# EAGLE design E-P-010-R1.0 SensorsPowerboard (EAGLE 7.5.0)
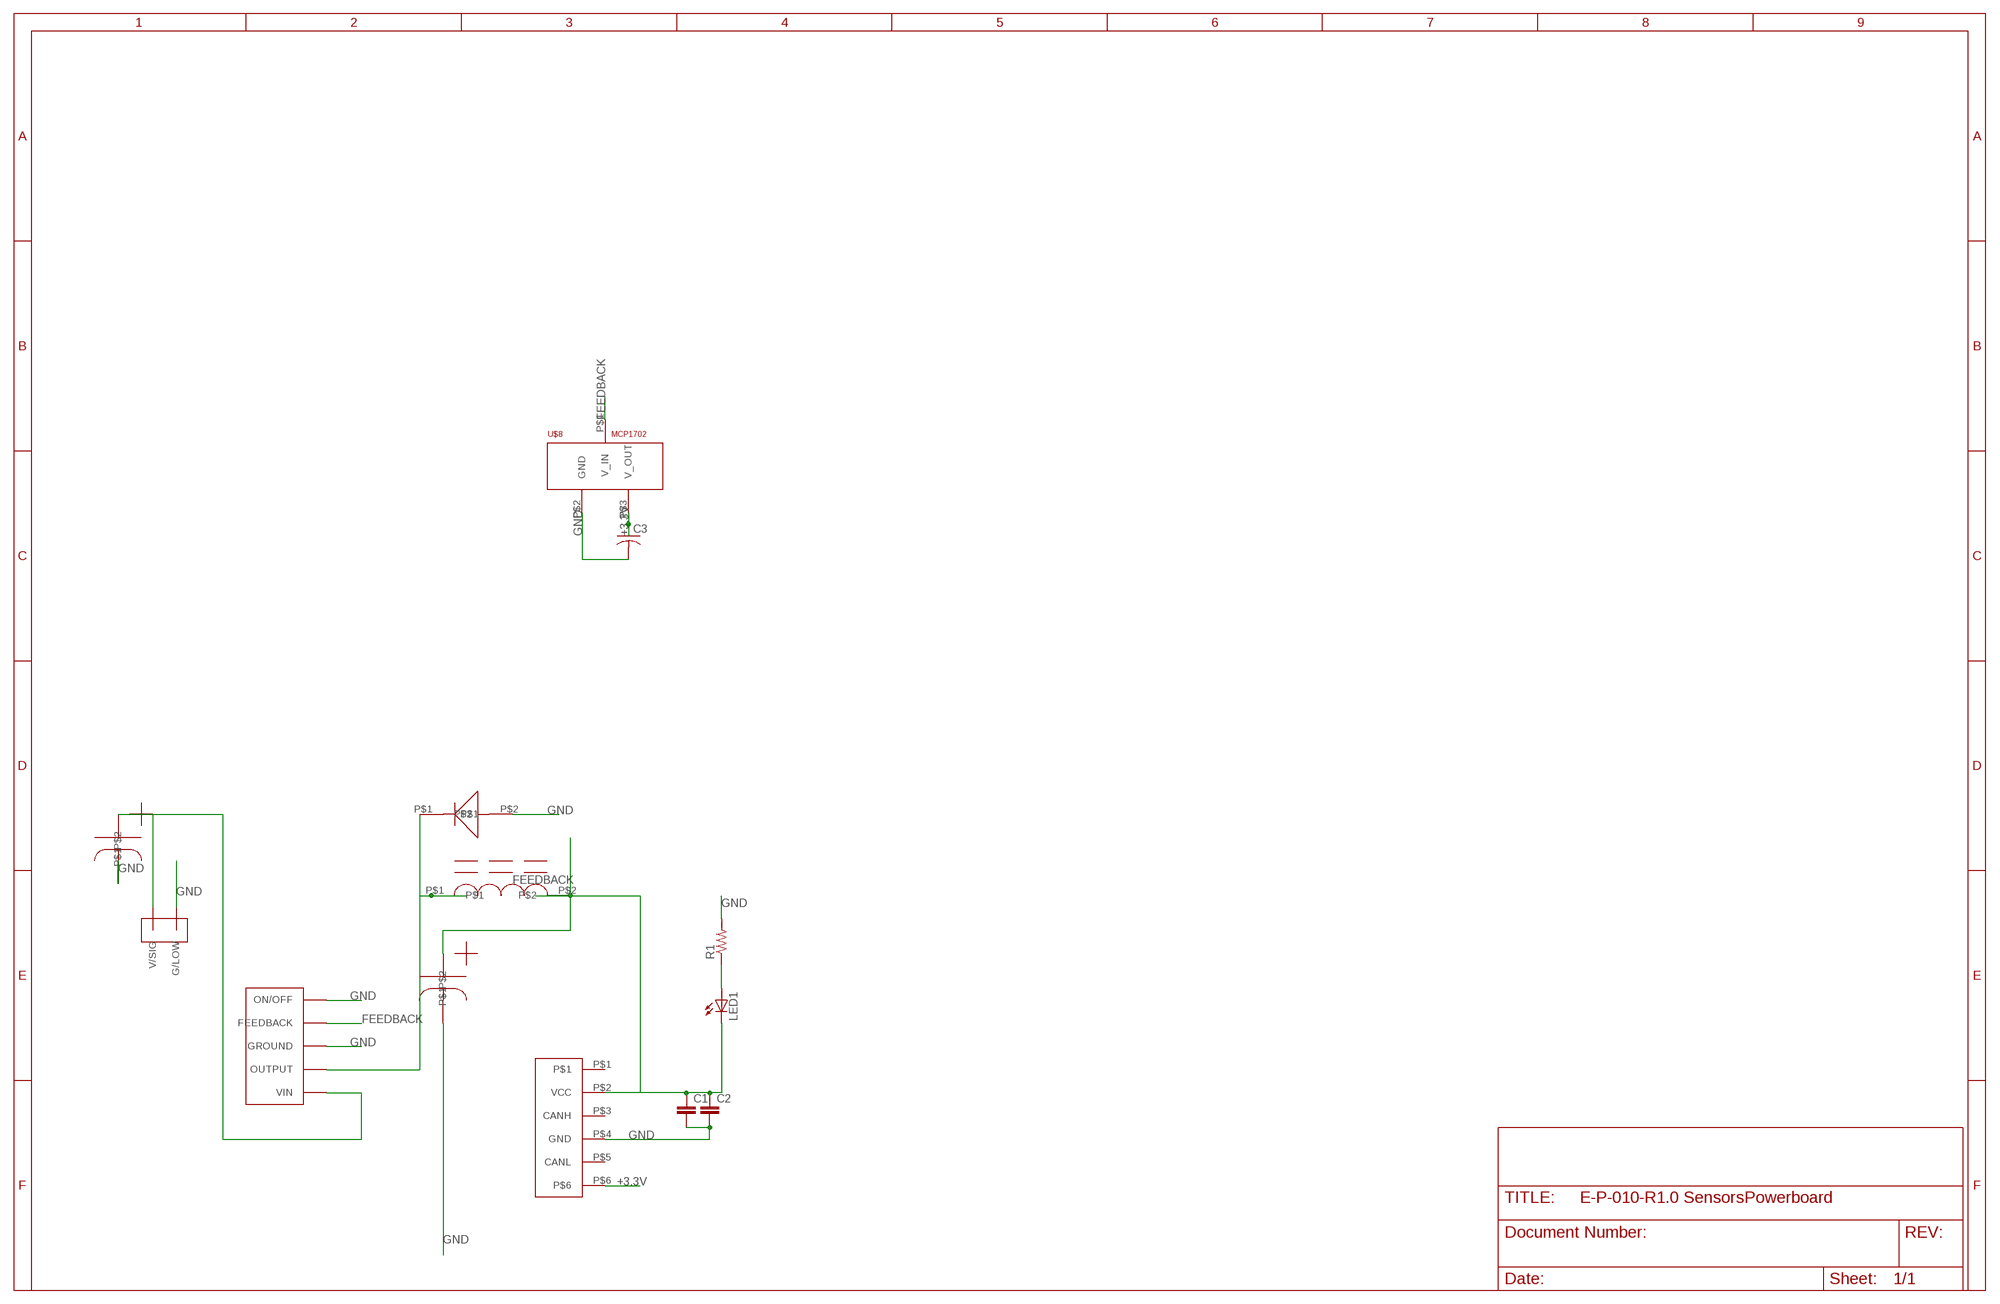
[diagram p0: schematic, sheet 1]

## Parts
C1  CAP0805  [0805]
C2  CAP0805  [0805]
C3  C-USC0805  [C0805]
LED1  LEDSMT1206  [1206]
R1  RESISTOR0805-RES  [0805]
U$1  LM2576  [D2PAK-5]
U$2  MBR360GOS  [MBR360GOS]
U$3  TE770966  [2X1-MATE-N-LOCK]
U$4  CAN_6P6C  [CAN_6P6C]
U$5  CAPESK107M025AC3AA  [ESK107M025AC3AA]
U$6  CAPESK108M025AH4EA  [ESK108M025AH4EA]
U$7  M1418-ND  [M1418-ND]
U$8  MCP1702  [SOT-23A]

## Nets
+3.3V: C3.1 U$4.P$6 U$8.P$3(V_OUT)
FEEDBACK: C1.1 C2.1 LED1.C U$1.4(FEEDBACK) U$4.P$2(VCC) U$6.P$1 U$7.P$2 U$8.P$1(V_IN)
GND: C1.2 C2.2 C3.2 R1.2 U$1.3(GROUND) U$1.5(ON/OFF) U$1.GROUND U$2.P$2 U$3.CIRCUIT2(G/LOW) U$4.P$4(GND) U$5.P$2 U$6.P$2 U$8.P$2(GND)
N$1: U$1.2(OUTPUT) U$2.P$1 U$7.P$1
N$3: LED1.A R1.1
V1: U$1.1(VIN) U$3.CIRCUIT1(V/SIG) U$5.P$1
Unconnected: U$4.P$1 U$4.P$3(CANH) U$4.P$5(CANL)

## Library data of the parts
C1 C2 = E-P-099-R2.2:CAP: Capacitor Standard 0603 ceramic capacitor, and 0.1" leaded capacitor.
C3 = adafruit:C-US: CAPACITOR, American symbol
LED1 = DAQTEST:LED: LED OSRAM: - CHIPLED LG R971, LG N971, LY N971, LG Q971, LY Q971, LO R971, LY R971 LH N974, LH R974 LS Q976, LO Q976, LY Q976 LO Q996 - Hyper CHIPLED LW Q18S LB Q993, LB Q99A, LB R99A - SideLED LS A670, LO A670, LY A670, LG A670, LP A670 LB A673, LV A673, LT A673, LW A673 LH A674 LY A675 LS A676, LA A676, LO A676, LY A676, LW A676 LS A679, LY A679, LG A679 - Hyper Micro SIDELED® LS Y876, LA Y876, LO Y876, LY Y876 LT Y87S - SmartLED LW L88C, LW L88S LB L89C, LB L89S, LG L890 LS L89K, LO L89K, LY L89K LS L896, LA L896, LO L896, LY L896 - TOPLED LS T670, LO T670, LY T670, LG T670, LP T670 LSG T670, LSP T670, LSY T670, LOP T670, LYG T670 LG T671, LOG T671, LSG T671 LB T673, LV T673, LT T673, LW T673 LH T674 LS T676, LA T676, LO T676, LY T676, LB T676, LH T676, LSB T676, LW T676 LB T67C, LV T67C, LT T67C, LS T67K, LO T67K, LY T67K, LW E67C LS E67B, LA E67B, LO E67B, LY E67B, LB E67C, LV E67C, LT E67C LW T67C LS T679, LY T679, LG T679 LS T770, LO T770, LY T770, LG T770, LP T770 LB T773, LV T773, LT T773, LW T773 LH T774 LS E675, LA E675, LY E675, LS T675 LS T776, LA T776, LO T776, LY T776, LB T776 LHGB T686 LT T68C, LB T68C - Hyper Mini TOPLED® LB M676 - Mini TOPLED Santana® LG M470 LS M47K, LO M47K, LY M47K Source: http://www.osram.convergy.de LUXEON: - LUMILED® LXK2-PW12-R00, LXK2-PW12-S00, LXK2-PW14-U00, LXK2-PW14-V00 LXK2-PM12-R00, LXK2-PM12-S00, LXK2-PM14-U00 LXK2-PE12-Q00, LXK2-PE12-R00, LXK2-PE12-S00, LXK2-PE14-T00, LXK2-PE14-U00 LXK2-PB12-K00, LXK2-PB12-L00, LXK2-PB12-M00, LXK2-PB14-N00, LXK2-PB14-P00, LXK2-PB14-Q00 LXK2-PR12-L00, LXK2-PR12-M00, LXK2-PR14-Q00, LXK2-PR14-R00 LXK2-PD12-Q00, LXK2-PD12-R00, LXK2-PD12-S00 LXK2-PH12-R00, LXK2-PH12-S00 LXK2-PL12-P00, LXK2-PL12-Q00, LXK2-PL12-R00 Source: www.luxeon.com KINGBRIGHT: KA-3528ASYC Source: www.kingbright.com
R1 = E-P-099-R2.2:RESISTOR: Resistor Basic schematic elements and footprints for 0603, 1206, and PTH resistors.
U$1 = Shell2015:LM2576
U$2 = Shell2013:MBR360GOS
U$3 = E-P-099-R2.2:TE770966
U$4 = Shell2013:CAN_6P6C: Digikey part: 553-2258-ND
U$5 U$6 = Shell2015:CAP
U$7 = Shell2015:M1418-ND: 100uF inductor
U$8 = Shell2015:MCP1702

## Board
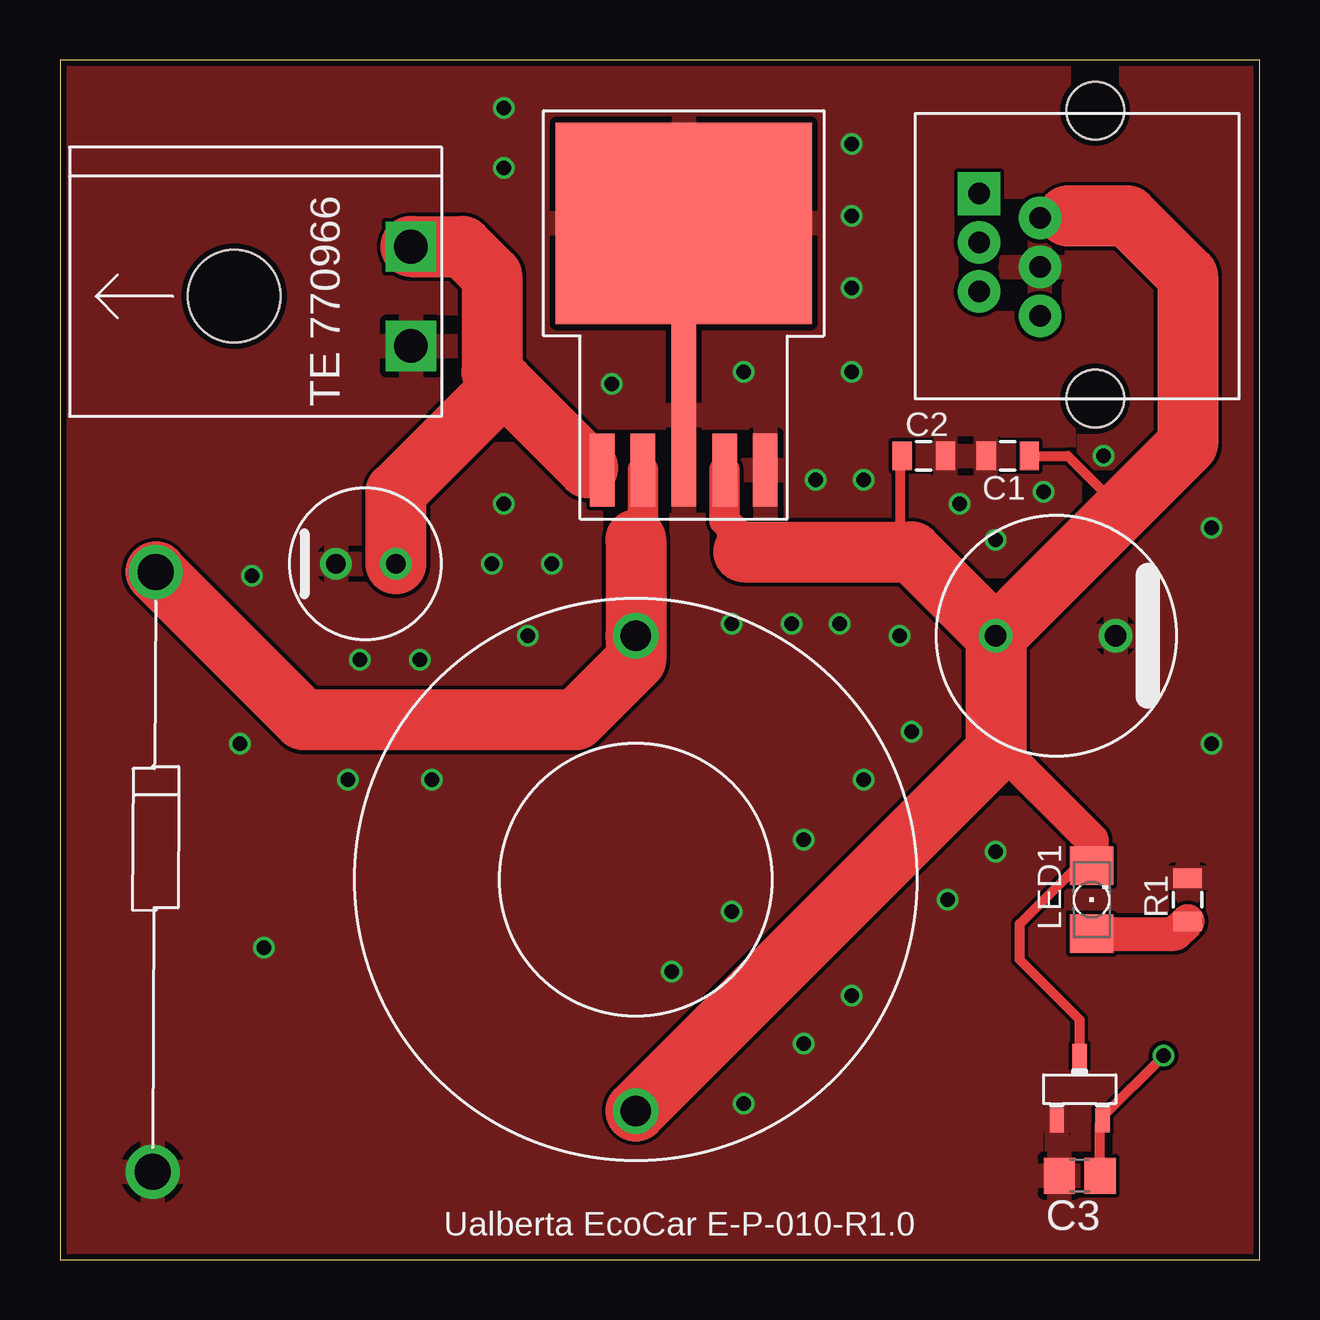
[diagram p1: board, top side]
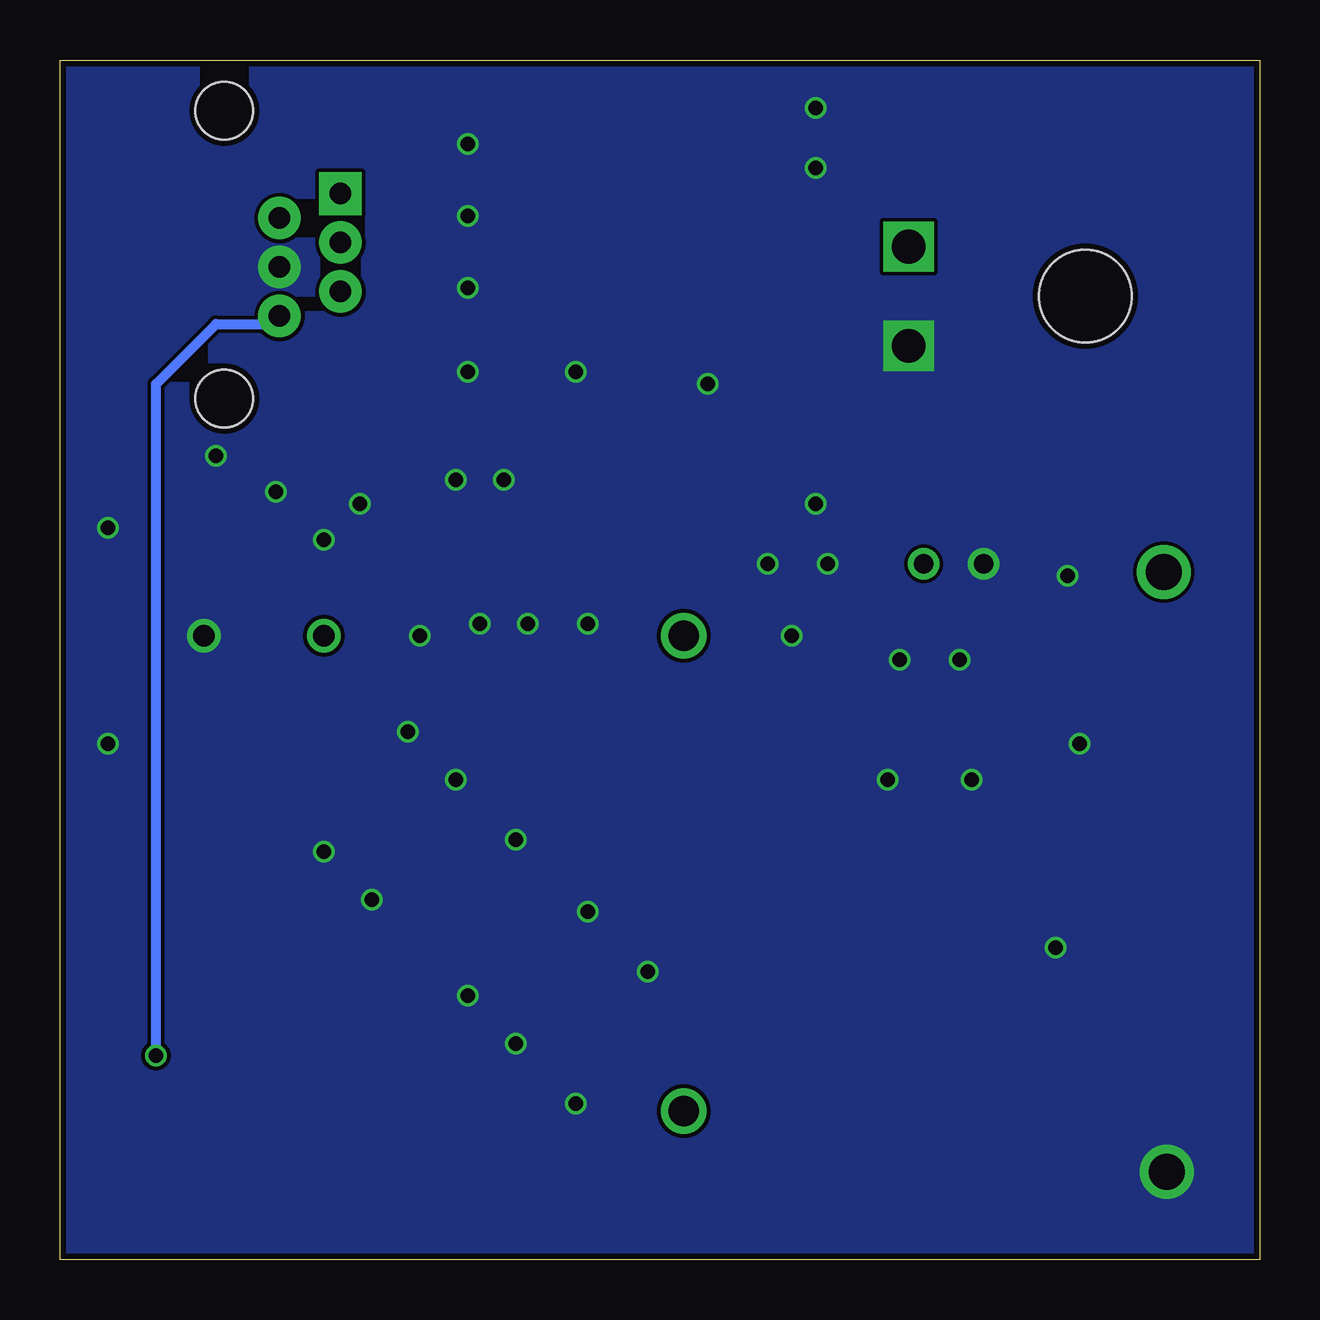
[diagram p2: board, bottom side, seen from below]

Size 50 x 50 mm. Coordinates in mm from the lower left corner, seen from the top.
Outline: 0,0 50,0 50,50 0,50 0,0
Copper layers (1*16): Top 0.035mm / dielectric 1.5mm / Bottom 0.035mm
Design rules "SeeedStudio_2layer_DRU_no_angle_20140221": minimum track width 6mil, minimum drill 12mil, track to track 6mil, track to pad 6mil, pad to pad 6mil, via to via 6mil, smd to smd 0mil, copper to edge 10mil, drill to drill 10mil, minimum pad ring 10mil, minimum via ring 6mil, stop-mask expansion 2mil, vias tented up to drill 100mil, thermal gap 10mil

### Footprints (pad centres in the part's own frame; a part is rotated, then mirrored left to right if it is on the bottom)
0805 = smd 0.8 x 1.2: 1 -0.9,0; 2 0.9,0
C0805 = smd 1.3 x 1.5: 1 -0.85,0; 2 0.85,0
1206 = smd 1.6 x 1.803: A -1.422,0; C 1.422,0
D2PAK-5 = smd 3.048 x 1.016: 1 6.096,-3.404; 2 6.096,-1.702; 4 6.096,1.702; 5 6.096,3.404 | smd 7.62 x 1.016: 3 3.81,0 | smd 8.382 x 10.668: GROUND -4.191,0
MBR360GOS = drill 1.5: P$1 0,0; P$2 25,0
2X1-MATE-N-LOCK = drill 1.4 square: CIRCUIT1 -2.07,14.23; CIRCUIT2 2.07,14.23 | hole 3.86: 0,6.86
CAN_6P6C = drill 0.9 pad 1.778 square: P$1 4.08,0 | drill 0.9 pad 1.778: P$2 3.06,-2.54; P$3 2.04,0; P$4 1.02,-2.54; P$5 0,0; P$6 -1.02,-2.54 | hole 2.4: -4.47,-4.84; 7.53,-4.84
ESK107M025AC3AA = drill 0.8: P$1 0,0; P$2 2.5,0
ESK108M025AH4EA = drill 0.9: P$1 0,0; P$2 5,0
M1418-ND = drill 1.27: P$1 0,0; P$2 19.812,0
SOT-23A = smd 0.6 x 1: P$1 0,0; P$2 -0.95,-2.7; P$3 0.95,-2.7

### Placement (x,y rotation side)
C1  39.5,33.5 180 top
C2  36,33.5 0 top
C3  42.5,3.5 180 top
LED1  43,15 90 top
R1  47,15 90 top
U$1  26,39 270 top
U$2  3.99,28.66 269.7 top
U$3  0.4,40.15 270 top
U$4  38.31,40.35 90 top
U$5  14,29 180 top
U$6  39,26 0 top
U$7  24,26 270 top
U$8  42.5,8.5 0 top

### Tracks (layer width: path | path; a pad name or v marks a point on that pad's centre or on a via)
+3.3V  (via drill 0.6)
  Top 0.406: C3.1 43.35,5.7 U$8.P$3 43.45,5.95 v46,8.5
  Bottom 0.406: v46,8.5 46,36.5 43.5,39 41.18,39 U$4.P$6
FEEDBACK
  Top 0.406: C2.1 35,33.5 35,29.5 | C1.1 42,33.5 44.25,31.25 | U$8.P$1 42.5,10 40,12.5 40,14 43,17
  Top 1.27: U$1.4 27.7,30.8 28,30.5 28,30 28.5,29.5
  Top 1.422: U$4.P$2 41.91,43.41 42,43.5 | LED1.C 43,17 43,17.5 39,21.5
  Top 2.54: 28.5,29.5 35,29.5 35.5,29.5 U$6.P$1 | U$6.P$1 44.25,31.25 47,34 47,41 44.5,43.5 42,43.5 | U$6.P$1 39,21.5 39,21.19 U$7.P$2
GND  (via drill 0.6)
  other vias: 8.5,13 18.5,31.5 20.5,29 18,29 19.5,26 28,26.5 23,36.5 28.5,37 33,37 33,40.5 33,43.5 33,46.5 18.5,48 18.5,45.5 30.5,26.5 32.5,26.5 35,26 31.5,32.5 33.5,32.5 37.5,31.5 39,30 15,25 12.5,25 15.5,20 12,20 7.5,21.5 8,28.5 41,32 48,30.5 48,21.5 28.5,6.5 31,9 33,11 37,15 39,17 35.5,22 33.5,20 31,17.5 28,14.5 25.5,12 43.5,33.5
  pour Bottom (no thermals): -2,52 53,52 53,-2 -5,-2 -3,52
  pour Top: -2,52 52,52 52,-2 -3,-2 -3,52
N$1
  Top 1.27: U$1.2 24.3,30.3 24,30
  Top 2.54: 24,30 U$7.P$1 24,25 21.5,22.5 10.15,22.5 U$2.P$1
N$3
  Top 1.422: LED1.A 46.48,13.58 R1.1
V1
  Top 1.27: 22,33 22.5,33 U$1.1
  Top 2.54: U$3.CIRCUIT1 16.78,42.22 18,41 18,37 18.5,36.5 | 18.5,36.5 22,33 | U$5.P$1 14,32 18.5,36.5

### Text on the board
tPlace: Ualberta EcoCar E-P-010-R1.0